# Altium schematic sheet fpga-bank8.SchDoc: FPGA - Bank 8
size Letter; CompanyName: Brinton Engineering, LLC; Address1: 3479 Edison Way; Address2: Menlo Park CA 94025; Address3: +1 (877) 778-8435; Address4: brintonengineering.com; Revision: 1; SheetNumber: 1; SheetTotal: 1
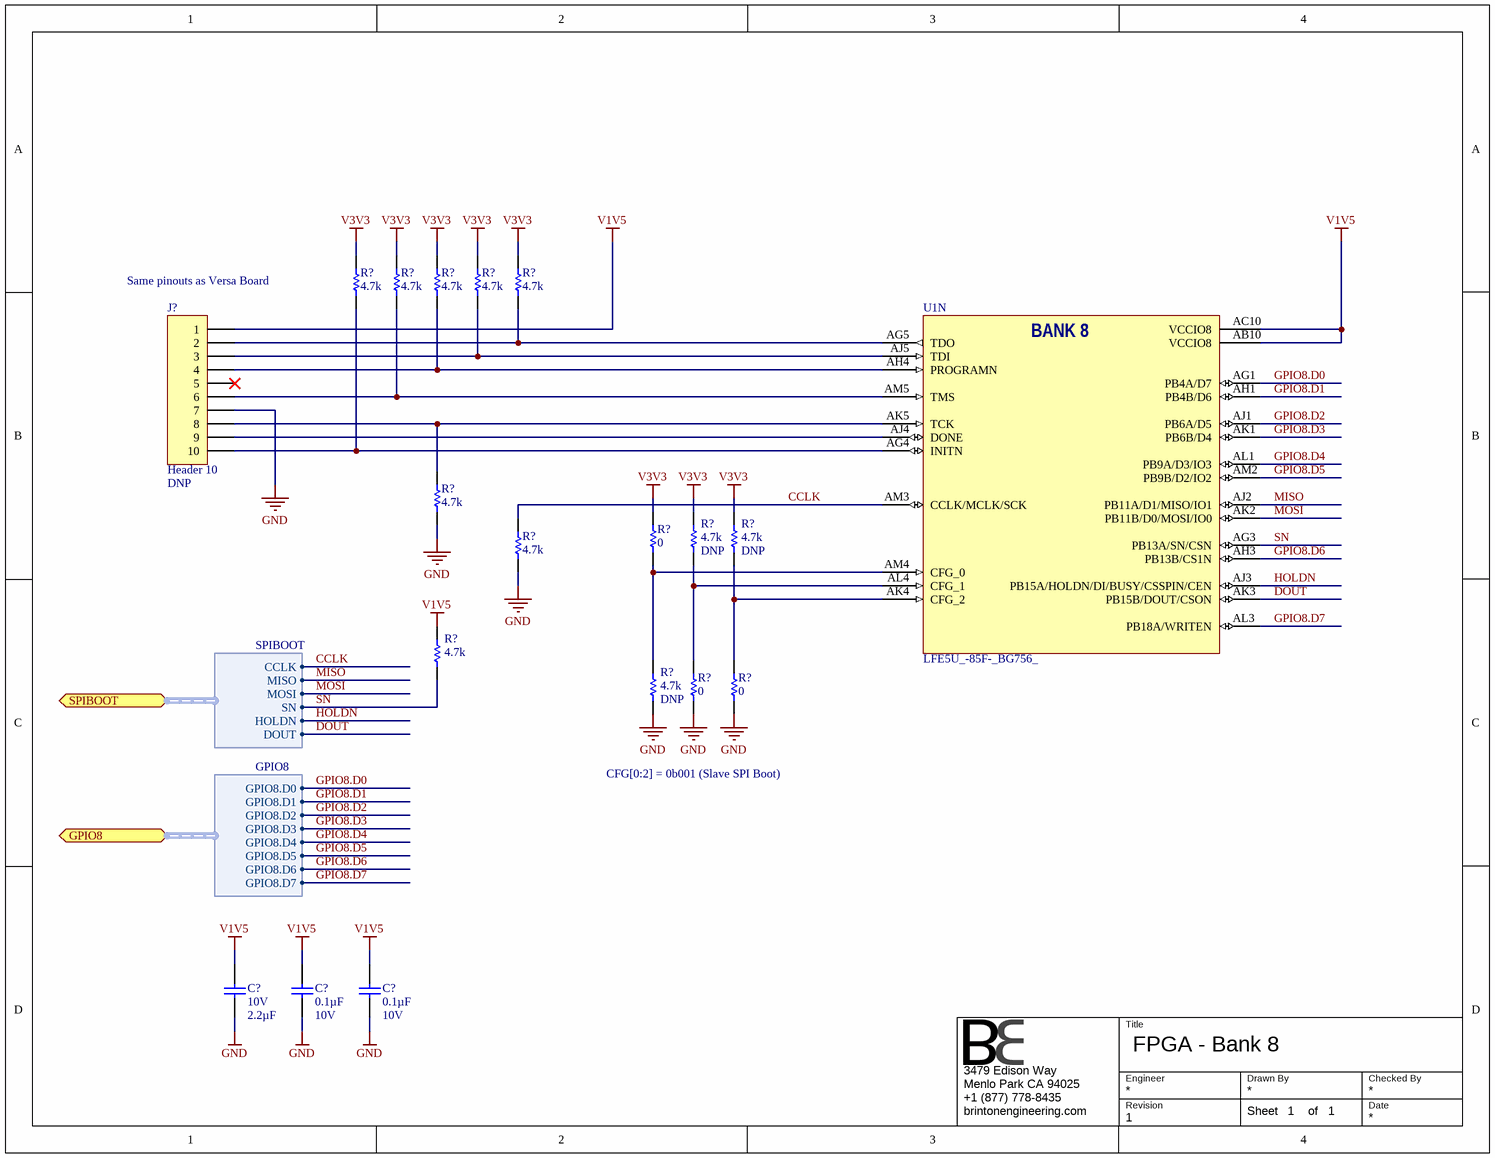
[diagram p0: fpga-bank8.SchDoc]

## Parts
(Parts that share a designator on the sheet are numbered #1, #2 ... from top to bottom, then left to right.)
C?#1  Voltage - Rated: 10V  Capacitance: 2.2µF  [CAPC1608X90N]  (hidden comment: GRM188R71A225KE15D)
C?#2  Capacitance: 0.1µF  Voltage - Rated: 10V  [CAPC1005X56N]  (hidden comment: GRM155R71A104KA01J)
C?#3  Capacitance: 0.1µF  Voltage - Rated: 10V  [CAPC1005X56N]  (hidden comment: GRM155R71A104KA01J)
J?  Header 10  Do Not Place: DNP  [HDR1X10]
R?#1  value 4.7k  [0603]  (hidden comment: RES 0603 4.7k 1%)
R?#2  value 4.7k  [0603]  (hidden comment: RES 0603 4.7k 1%)
R?#3  value 4.7k  [0603]  (hidden comment: RES 0603 4.7k 1%)
R?#4  value 4.7k  [0603]  (hidden comment: RES 0603 4.7k 1%)
R?#5  value 4.7k  [0603]  (hidden comment: RES 0603 4.7k 1%)
R?#6  value 4.7k  [0603]  (hidden comment: RES 0603 4.7k 1%)
R?#7  value 0  [0603]  (hidden comment: RES 0603 0)
R?#8  value 4.7k  Do Not Place: DNP  [0603]  (hidden comment: RES 0603 4.7k 1%)
R?#9  value 4.7k  Do Not Place: DNP  [0603]  (hidden comment: RES 0603 4.7k 1%)
R?#10  value 4.7k  [0603]  (hidden comment: RES 0603 4.7k 1%)
R?#11  value 4.7k  [0603]  (hidden comment: RES 0603 4.7k 1%)
R?#12  value 4.7k  Do Not Place: DNP  [0603]  (hidden comment: RES 0603 4.7k 1%)
R?#13  value 0  [0603]  (hidden comment: RES 0603 0)
R?#14  value 0  [0603]  (hidden comment: RES 0603 0)
U1  LFE5U_-85F-_BG756_  [caBGA756]  (part N of 19)

## Ports
GPIO8 (harness GPIO8), SPIBOOT (harness SPIBOOT)

## Harnesses
SPIBOOT: CCLK, MISO, MOSI, SN, HOLDN, DOUT
GPIO8: GPIO8.D0, GPIO8.D1, GPIO8.D2, GPIO8.D3, GPIO8.D4, GPIO8.D5, GPIO8.D6, GPIO8.D7

## Nets
GND: C?#1.1 C?#2.1 C?#3.1 J?.7 R?#6.1 R?#10.1 R?#12.1 R?#13.1 R?#14.1
V1V5: C?#1.2 C?#2.2 C?#3.2 J?.1 R?#11.2 U1.AB10(VCCIO8) U1.AC10(VCCIO8)
V3V3: R?#1.2 R?#2.2 R?#3.2 R?#4.2 R?#5.2 R?#7.2 R?#8.2 R?#9.2
CCLK: R?#10.2 U1.AM3(CCLK/MCLK/SCK) ; port SPIBOOT.CCLK
DOUT: U1.AK3(PB15B/DOUT/CSON) ; port SPIBOOT.DOUT
GPIO8.D0: U1.AG1(PB4A/D7) ; port GPIO8.GPIO8.D0
GPIO8.D1: U1.AH1(PB4B/D6) ; port GPIO8.GPIO8.D1
GPIO8.D2: U1.AJ1(PB6A/D5) ; port GPIO8.GPIO8.D2
GPIO8.D3: U1.AK1(PB6B/D4) ; port GPIO8.GPIO8.D3
GPIO8.D4: U1.AL1(PB9A/D3/IO3) ; port GPIO8.GPIO8.D4
GPIO8.D5: U1.AM2(PB9B/D2/IO2) ; port GPIO8.GPIO8.D5
GPIO8.D6: U1.AH3(PB13B/CS1N) ; port GPIO8.GPIO8.D6
GPIO8.D7: U1.AL3(PB18A/WRITEN) ; port GPIO8.GPIO8.D7
HOLDN: U1.AJ3(PB15A/HOLDN/DI/BUSY/CSSPIN/CEN) ; port SPIBOOT.HOLDN
MISO: U1.AJ2(PB11A/D1/MISO/IO1) ; port SPIBOOT.MISO
MOSI: U1.AK2(PB11B/D0/MOSI/IO0) ; port SPIBOOT.MOSI
SN: R?#11.1 U1.AG3(PB13A/SN/CSN) ; port SPIBOOT.SN
NetJ?_2: J?.2 R?#5.1 U1.AG5(TDO)
NetJ?_3: J?.3 R?#4.1 U1.AJ5(TDI)
NetJ?_4: J?.4 R?#3.1 U1.AH4(PROGRAMN)
NetJ?_6: J?.6 R?#2.1 U1.AM5(TMS)
NetJ?_8: J?.8 R?#6.2 U1.AK5(TCK)
NetJ?_9: J?.9 U1.AJ4(DONE)
NetJ?_10: J?.10 R?#1.1 U1.AG4(INITN)
NetR?#7_1: R?#7.1 R?#12.2 U1.AM4(CFG_0)
NetR?#8_1: R?#8.1 R?#13.2 U1.AL4(CFG_1)
NetR?#9_1: R?#9.1 R?#14.2 U1.AK4(CFG_2)

Not connected (* = marked no-connect by the designer): J? 5*

## Notes on the sheet
- (near J?) Same pinouts as Versa Board
- CFG[0:2] = 0b001 (Slave SPI Boot)
- Title
- Engineer
- Revision
- Drawn By
- Checked By
- Date
- Sheet
- of
- (in symbol LFE5U_-85F-_BG756_, part N) BANK 8

## Library data of the parts
C?#1 = GRM188R71A225KE15D: CAP CER 2.2UF 10V 10% X7R 0603; Manufacturer: Murata Electronics North America; Manufacturer P/N: GRM188R71A225KE15D; Operating Temperature: -55°C ~ 125°C; Thickness (Max): 0.035" (0.90mm); Tolerance: ±10%; Package / Case: 0603 (1608 Metric); Temperature Coefficient: X7R; Supplier 1: Newark; Supplier 2: Digi-Key; RoHS: RoHS Compliant; Size / Dimension: 0.063" L x 0.031" W (1.60mm x 0.80mm); Mounting Type: Surface Mount, MLCC; ComponentLink1URL: http://www.murata.com/~/media/webrenewal/support/library/catalog/products/capacitor/mlcc/c02e.ashx; ComponentLink1Description: http://www.murata.com/~/media/webrenewal/support/library/catalog/products/capacitor/mlcc/c02e.ashx; Supplier Part Number 1: 72R4209; Supplier Part Number 2: 490-4520-1-ND
C?#2 C?#3 = GRM155R71A104KA01J: CAP CER 0.1UF 10V 10% X7R 0402; Manufacturer: Murata Electronics North America; Manufacturer P/N: GRM155R71A104KA01J; Operating Temperature: -55°C ~ 125°C; Thickness (Max): 0.022" (0.55mm); Size / Dimension: 0.039" L x 0.020" W (1.00mm x 0.50mm); RoHS: RoHS Compliant; Mounting Type: Surface Mount, MLCC; Supplier 1: Digi-Key; ComponentLink1URL: http://www.murata.com/~/media/webrenewal/support/library/catalog/products/capacitor/mlcc/c02e.ashx; ComponentLink1Description: http://www.murata.com/~/media/webrenewal/support/library/catalog/products/capacitor/mlcc/c02e.ashx; Supplier Part Number 1: 490-6322-1-ND; Temperature Coefficient: X7R; Package / Case: 0402 (1005 Metric); Tolerance: ±10%
J? = Header 10: Header, 10-Pin; LatestRevisionDate: 17-Jul-2002; LatestRevisionNote: Re-released for DXP Platform.; Publisher: Altium Limited
R?#1-R?#6 R?#8-R?#12 = RES 0603 10k 1%: Thick Film Resistor 4.7k Ohms +/-1% 0.1W 75V SMD 0603; Manufacturer: Panasonic - ECG; Manufacturer P/N: ERJ3EKF4701V; Tcr: +/-100; Tr: -55:+155; Tolerance: +/-1%; Alternatives: *; Voltage: 75V; Power: 0.1W; P/N: ERJ3EKF4701V
  R?#11: Do Not Place: *
R?#7 R?#13 R?#14 = RES 0603 10k 1%: Thick Film Resistor 0 Ohms SMD 0603; Manufacturer: Panasonic - ECG; Manufacturer P/N: ERJ-3GEY0R00V; Tcr: +/-100; Tolerance: +/-1%; Tr: -55:+155; Voltage: 75V; Power: 0.1W; Alternatives: *; P/N: ERJ-3GEY0R00V
U1 = LFE5U_-85F-_BG756_: ECP5 FPGA, 85k LUT, 756-caBGA; Manufacturer: Lattice Semiconductor; Manufacturer P/N: LFE5U_-85F-_BG756_